# Altium schematic sheet PowerInSchematic.SchDoc
size A4
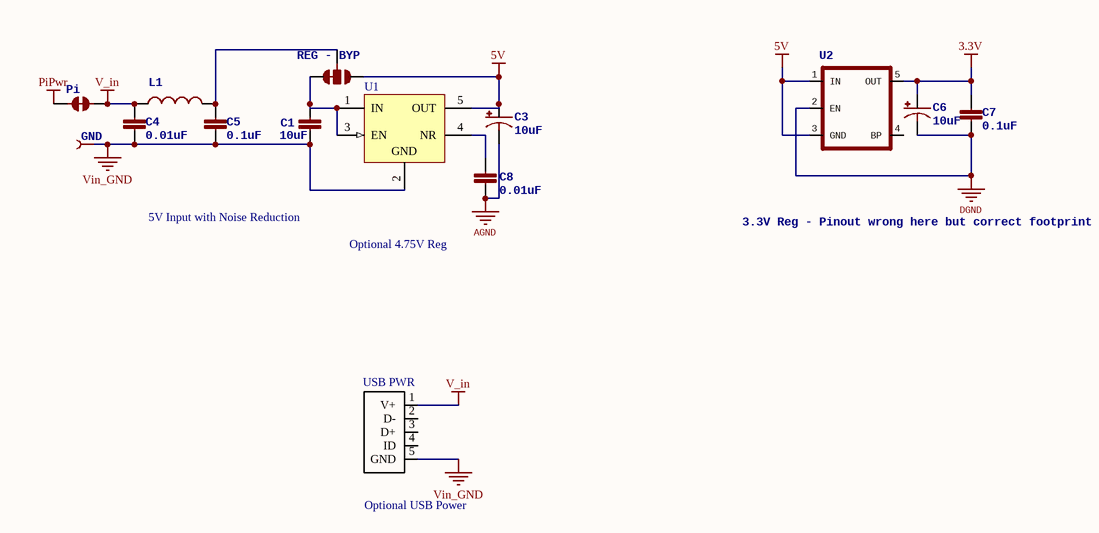
[diagram p0: PowerInSchematic.SchDoc]

## Parts
C1  10uF  [0603-CAP]
C3  10uF  [EIA3216]
C4  0.01uF  [0603-CAP]
C5  0.1uF  [0603-CAP]
C6  10uF  [EIA3216]
C7  0.1uF  [0603-CAP]
C8  0.01uF  [0603-CAP]
GND  TEST-POINT3  [PAD.03X.03]  (value not drawn)
L1  (no value)  [0805]
Pi  JUMPER-PAD-2-NC_BY_TRACENO_SILK  [PAD-JUMPER-2-NC_BY_TRACE_NO_SILK]  (value not drawn)  (net tie, no BOM)
REG_-_BYP  JUMPER-PAD-3-2OF3_NC_BY_TRACE_SMALL  [3 pad jumper 2 of 3 connected no silk screen]  (value not drawn)  (net tie, no BOM)
U1  Optional 4.75V Reg  [TI-DBV5_N]
U2  3.3V Reg - Pinout wrong here but correct footprint  [TI-DBV5_N]
USB_PWR  Optional USB Power  [MicroUSB-HRS1]

## Nets
3.3V: C6.A(+) C7.1 U2.5(OUT)
5V: C3.A(+) REG_-_BYP.1 U1.5(OUT) U2.1(IN) U2.3(GND)
AGND: C3.C(-) C8.2
DGND: C6.C(-) C7.2 U2.2(EN)
PiPwr: Pi.1
V_in: C4.1 L1.1 Pi.2 USB_PWR.1(V+)
Vin_GND: C1.2 C4.2 C5.2 GND.P$1 U1.2(GND) USB_PWR.5(GND)
NetC1_1: C1.1 REG_-_BYP.3 U1.1(IN) U1.3(EN)
NetC5_1: C5.1 L1.2 REG_-_BYP.2
NetC8_1: C8.1 U1.4(NR)

Not connected (* = marked no-connect by the designer): U2 4(BP); USB_PWR 2(D-) 3(D+) 4(ID)

## Notes on the sheet
- 5V Input with Noise Reduction

## Library data of the parts
C1 C4 C5 C7 C8 = 0.1UF-25V-5%(0603): Part#: assortment; Picked: true; Type: ceramic
  C1 C5 C7: Cost: 0.023
  C4 C8: Cost: 0.025
C3 C6 = CAP_POL1206: Capacitor PolarizedThese are standard SMD and PTH capacitors. Normally 10uF, 47uF, and 100uF in electrolytic and tantalum varieties. Always verify the external diameter of the through hole cap, it varies with capacity, voltage, and manufacturer. The EIA devices should be standard.; Part#: Vishay 10μF 16 V dc Tantalum Capacitor MnO2 Solid ±10% tolerance 593D series; Picked: awaiting; Type: tantalum; Site: http://uk.rs-online.com/web/p/tantalum-capacitors/6844443/; Datasheet: http://uk.rs-online.com/webdocs/0d97/0900766b80d97c10.pdf
L1 = INDUCTOR0805: Inductors   Basic Inductor/Choke - 0603 and 1206. Footprints are not proven and vary greatly between part numbers. INDUCTOR POWER 3.3UH 4.0A SMD 0.197" L x 0.197" W x 0.177" H (5.00mm x 5.00mm x 4.50mm); Part#: mpz2012s331a; Picked: true; Datasheet: http://www.farnell.com/datasheets/55169.pdf?_ga=1.185637866.2111588679.1477695937; Site: https://uk.farnell.com/webapp/wcs/stores/servlet/ProductDisplay?catalogId=15001&CMP=i-ddd7-00001003&langId=44&storeId=10151&krypto=bBMrL5yVwIWI6u6Yca2X37o31oBvpgYGX66w9sSnKmrTVf6dRWZkStNvtfBlA%2BxcZyCJrovIgVW5IV9XR9GO%2BnYYLBu6Vx6claKpfbiAkEiOIN6Kh5mWTnuG6WiCqOMd8E3SWVDAErVMuxMPX5%2BXzQ%3D%3D&ddkey=http%3Aen-GB%2FElement14_United_Kingdom%2Ftdk%2Fmpz2012s331at000%2Fferrite-bead-0-05ohm-2-5a-0805%2Fdp%2F1301679; Cost: 0.0832
U1 = TPS793475DBVR: Single Output High PSRR LDO, 200 mA, Fixed 4.75 V Output, 2.7 to 5.5 V Input, 5-pin SOT-23 (DBV), -40 to 85 degC, Green (RoHS & no Sb/Br); Manufacturer: Texas Instruments; Accuracy(%): 2; Fixed Output Options(V): 4.75; Iout(Max)(A): 0.2; Rating: Catalog; SubFamily: Single Channel LDO; Vdo(Typ)(mV): 77; Vin(Max)(V): 5.5; Vin(Min)(V): 2.7; DatasheetVersion: SLVS348K; PackageVersion: 4073253-4/K; PackageReference: DBV5; PackageDescription: 5-Pin Plastic Small Outline, Body 1.60 Ã— 2.90 mm, Pitch 0.95 mm; Supplier 1: Digi-Key; Supplier Part Number 1: 296-12160-2-ND; Supplier 2: Digi-Key; Supplier Part Number 2: 296-12160-1-ND; Supplier 3: Digi-Key; Supplier Part Number 3: 296-12160-6-ND; Supplier 4: Newark; Supplier Part Number 4: 77C1366; Supplier 5: Mouser; Supplier Part Number 5: 595-TPS793475DBVR; Eco-Plan: Green (RoHS & no Sb/Br); Iq(Typ)(mA): 0.2; Vout Adj(Max)(V): 4.75; Vout Adj(Min)(V): 4.75; Mounting Technology: Surface Mount; Code_JEDEC: MO-178; PartNumber: TPS793475DBVR; ComponentLink1Description: Manufacturer URL; ComponentLink1URL: http://www.ti.com/; ComponentLink2Description: Datasheet; ComponentLink2URL: http://www.ti.com/general/docs/lit/getliterature.tsp?genericPartNumber=TPS793475&fileType=pdf; ComponentLink3Description: Package Specification; ComponentLink3URL: http://www.ti.com/litv/pdf/mpds018i; ComponentLink4Description: URL Link1; ComponentLink4URL: Samples URL:http://www.ti.com/product/tps793475#samples
U2 = MIC52053.3V: Part#: MIC5205-3.3YM5-TR; Picked: true; Site: http://uk.farnell.com/webapp/wcs/stores/servlet/ProductDisplay?catalogId=15001&langId=44&urlRequestType=Base&partNumber=2510222&storeId=10151; Datasheet: http://www.farnell.com/datasheets/29605.pdf?_ga=1.85606106.2111588679.1477695937; Cost: 0.317
USB_PWR = MicroUSB-HRS-ZX62-AB-5PA: Part#: assortment; Picked: true; Best.Nr (Farnell): 1645326; HelpURL: http://www.farnell.com/datasheets/81390.pdf; Cost: 0.45